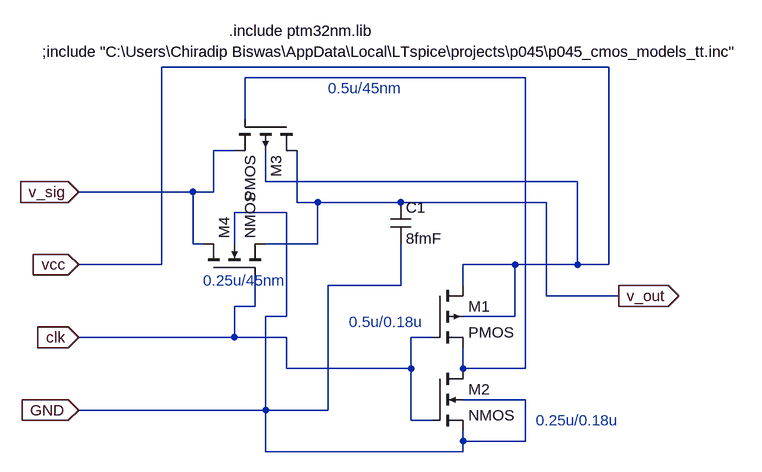
[diagram p0: schematic transmission_switch_100ns_5ns_5ps_8fmF_symbolCKT.asc]
transmission_switch_100ns_5ns_5ps_8fmF_symbolCKT.asc, the LTspice schematic file:
Version 4
SHEET 1 1200 680
WIRE 864 -144 176 -144
WIRE 736 -128 304 -128
WIRE 304 -64 304 -128
WIRE 288 -16 256 -16
WIRE 336 32 336 -16
WIRE 816 32 336 32
WIRE 224 48 48 48
WIRE 256 48 256 -16
WIRE 256 48 224 48
WIRE 384 64 384 -16
WIRE 416 64 384 64
WIRE 544 64 416 64
WIRE 768 64 544 64
WIRE 368 80 288 80
WIRE 224 128 224 48
WIRE 240 128 224 128
WIRE 288 128 288 80
WIRE 416 128 416 64
WIRE 416 128 336 128
WIRE 176 160 176 -144
WIRE 176 160 48 160
WIRE 720 160 640 160
WIRE 816 160 816 32
WIRE 816 160 720 160
WIRE 864 160 864 -144
WIRE 864 160 816 160
WIRE 544 192 544 128
WIRE 544 192 432 192
WIRE 640 192 640 160
WIRE 768 208 768 64
WIRE 880 208 768 208
WIRE 320 224 320 176
WIRE 320 224 288 224
WIRE 368 240 368 80
WIRE 368 240 336 240
WIRE 720 240 720 160
WIRE 720 240 640 240
WIRE 288 272 288 224
WIRE 288 272 48 272
WIRE 368 272 288 272
WIRE 592 272 560 272
WIRE 368 320 368 272
WIRE 560 320 560 272
WIRE 560 320 368 320
WIRE 640 320 640 288
WIRE 736 320 736 -128
WIRE 736 320 640 320
WIRE 736 368 640 368
WIRE 336 384 336 240
WIRE 336 384 48 384
WIRE 432 384 432 192
WIRE 432 384 336 384
WIRE 560 400 560 320
WIRE 592 400 560 400
WIRE 640 432 640 416
WIRE 736 432 736 368
WIRE 736 432 640 432
WIRE 336 448 336 384
WIRE 640 448 640 432
WIRE 640 448 336 448
FLAG 48 48 v_sig
IOPIN 48 48 In
FLAG 48 272 clk
IOPIN 48 272 In
FLAG 48 160 vcc
IOPIN 48 160 In
FLAG 880 208 v_out
IOPIN 880 208 Out
FLAG 48 384 GND
IOPIN 48 384 In
SYMBOL pmos4 592 192 R0
SYMATTR InstName M1
SYMATTR Value2 l=45nm w=30u
SYMBOL nmos4 592 320 R0
SYMATTR InstName M2
SYMATTR Value2 l=45nm w=15u
SYMBOL pmos4 384 -64 R90
SYMATTR InstName M3
SYMATTR Value2 l=45nm w=0.5u
SYMBOL nmos4 240 176 R270
SYMATTR InstName M4
SYMATTR Value2 l=45nm w=0.25u
SYMBOL cap 528 64 R0
SYMATTR InstName C1
SYMATTR Value 8fmF
TEXT 280 -200 Left 2 !.include ptm32nm.lib
TEXT 240 184 Left 2 ;0.25u/45nm
TEXT 752 400 Left 2 ;0.25u/0.18u
TEXT 464 248 Left 2 ;0.5u/0.18u
TEXT 432 -112 Left 2 ;0.5u/45nm
TEXT -8 -168 Left 2 !;include "C:\\Users\\Chiradip Biswas\\AppData\\Local\\LTspice\\projects\\p045\\p045_cmos_models_tt.inc"

The netlist it stands for:
* transmission_switch_100ns_5ns_5ps_8fmF_symbolCKT.asc
M1 vcc clk N001 vcc PMOS l=45nm w=30u
M2 N001 clk GND GND NMOS l=45nm w=15u
M3 v_out N001 v_sig vcc PMOS l=45nm w=0.5u
M4 v_sig clk v_out GND NMOS l=45nm w=0.25u
C1 v_out GND 8fmF
.model NMOS NMOS
.model PMOS PMOS
.lib standard.mos
.include ptm32nm.lib
* 0.25u/45nm
* 0.25u/0.18u
* 0.5u/0.18u
* 0.5u/45nm
;include "C:\Users\Chiradip Biswas\AppData\Local\LTspice\projects\p045\p045_cmos_models_tt.inc"
.backanno
.end